# EAGLE design current_monitor_v1.1 (EAGLE 6.5.0)
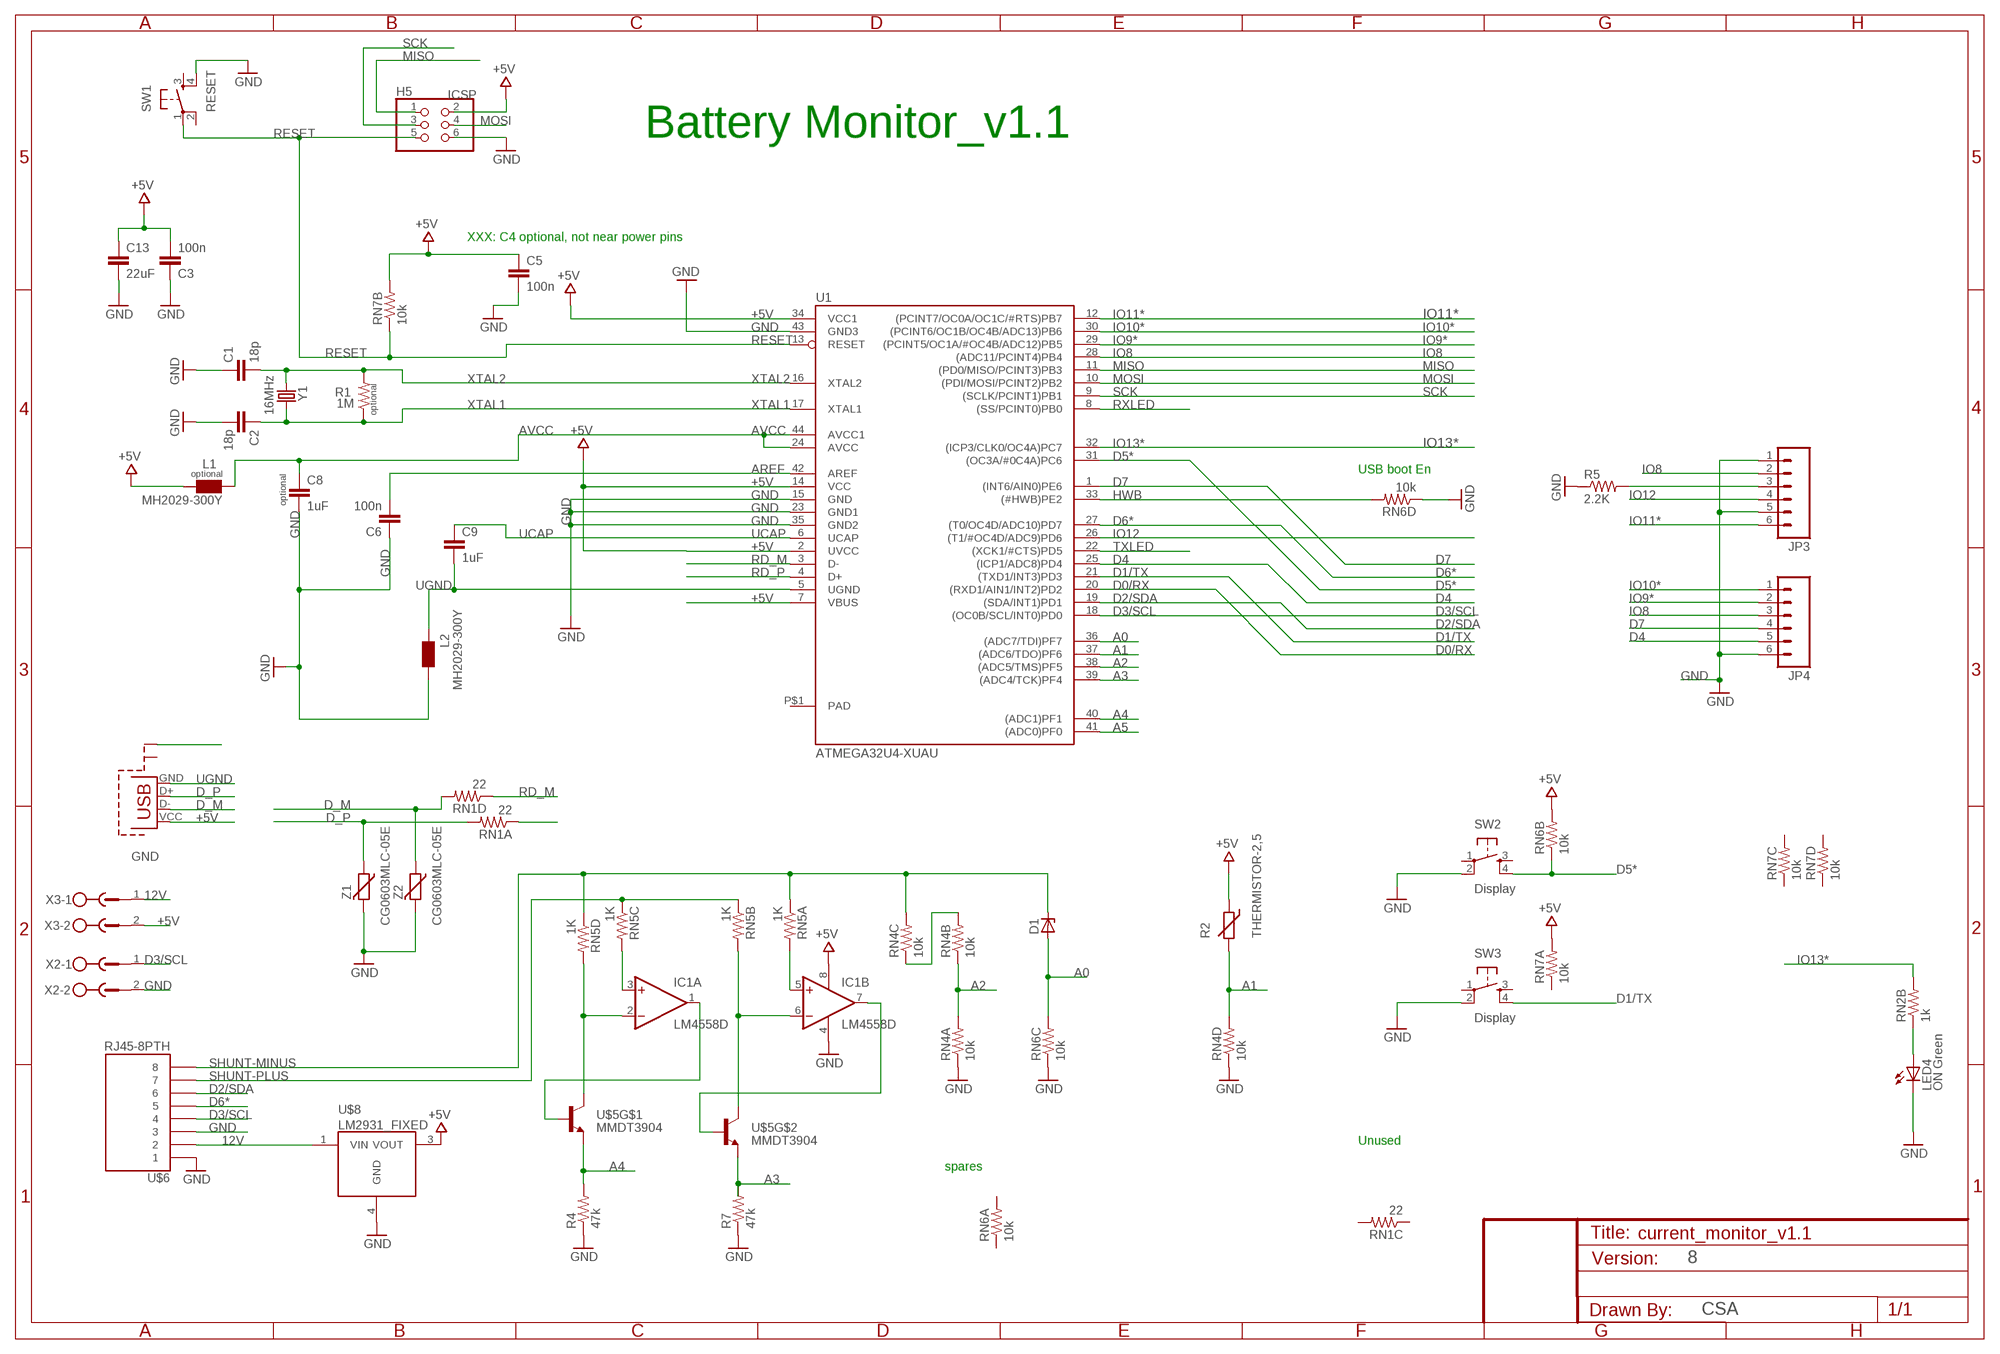
[diagram p0: schematic, sheet 1]

## Parts
C1  18p  CAP0805  [0805]
C2  18p  CAP0805  [0805]
C3  100n  CAP0805  [0805]
C5  100n  CAP0805  [0805]
C6  100n  CAP0805  [0805]
C8  1uF  CAP0805  [0805]
C9  1uF  CAP0805  [0805]
C13  22uF  CAP1206  [1206]
D1  ZENER-DIODEZD-5  [ZDIO-5]
H5  ICSP  PINHD-2X3  [2X03]
IC1  LM4558D  [SO08]
JP3  M06FEMALE_LOCK  [1X06_FEMALE_LOCK.010]
JP4  M06FEMALE_LOCK  [1X06_FEMALE_LOCK.010]
L1  MH2029-300Y  WE-CBF_0805  [0805]
L2  MH2029-300Y  WE-CBF_0805  [0805]
LED4  ON Green  LED0805  [LED0805]
R1  1M  RESISTOR0805-RES  [0805]
R2  THERMISTOR-2,5  [RS-2,5]
R4  47k  RESISTOR0805-RES  [0805]
R5  2.2K  RESISTOR0805-RES  [0805]
R7  47k  RESISTOR0805-RES  [0805]
RN1  22  RESISTOR-ARRAYCRA06S  [CRA06S]
RN2  1k  RESISTOR-ARRAYCRA06S  [CRA06S]
RN4  10k  RESISTOR-ARRAYCRA06S  [CRA06S]
RN5  1K  RESISTOR-ARRAYCRA06S  [CRA06S]
RN6  10k  RESISTOR-ARRAYCRA06S  [CRA06S]
RN7  10k  RESISTOR-ARRAYCRA06S  [CRA06S]
SW1  RESET  TAC_SWITCHPTH  [TACTILE-PTH]
SW2  Display  TAC_SWITCHPTH  [TACTILE-PTH]
SW3  Display  TAC_SWITCHPTH  [TACTILE-PTH]
U1  ATMEGA32U4-XUAU  [TQFP44-PAD]
U$5  MMDT3904  [SOT363]
U$6  RJ45-8PTH  [RJ45-8]
U$8  LM2931_FIXED  [DPAK]
U$12  USB-MICRO-B-EVT  [USB-MICRO-B-UNIVERSAL-SOLID-FOOTS]
X2  MSTBV2  [MSTBV2]
X3  MSTBV2  [MSTBV2]
Y1  16MHz  CRYSTALHC49US  [HC49US]
Z1  CG0603MLC-05E  VARISTORCN0603  [CT/CN0603]
Z2  CG0603MLC-05E  VARISTORCN0603  [CT/CN0603]

## Nets
12V: U$6.2 U$8.1(VIN) X3.1
+5V [power]: C3.2 C5.1 C13.1 H5.2 IC1.8(P:V+) L1.1 R2.1 RN6.7 RN7.7 RN7.8 U1.2(UVCC) U1.7(VBUS) U1.14(VCC) U1.34(VCC1) U$8.3(VOUT) U$12.VCC(VBUS) X3.2
A0: D1.A RN6.6 U1.36((ADC7/TDI)PF7)
A1: R2.2 RN4.5 U1.37((ADC6/TDO)PF6)
A2: RN4.2 RN4.8 U1.38((ADC5/TMS)PF5)
A3: R7.2 U1.39((ADC4/TCK)PF4) U$5.1(E)
A4: R4.2 U1.40((ADC1)PF1) U$5.4(E)
A5: U1.41((ADC0)PF0)
AREF [aref]: C6.2 U1.42(AREF)
AVCC: C8.1 L1.2 U1.24(AVCC) U1.44(AVCC1)
D0/RX: U1.20((RXD1/AIN1/INT2)PD2)
D1/TX: SW3.4 U1.21((TXD1/INT3)PD3)
D2/SDA: U1.19((SDA/INT1)PD1) U$6.6
D3/SCL: U1.18((OC0B/SCL/INT0)PD0) U$6.4 X2.1
D4: JP4.5 U1.25((ICP1/ADC8)PD4)
D5*: RN6.2 SW2.4 U1.31((OC3A/#0C4A)PC6)
D6*: U1.27((T0/OC4D/ADC10)PD7) U$6.5
D7: JP4.4 U1.1((INT6/AIN0)PE6)
D_M: RN1.5 U$12.D- Z2.1
D_P: RN1.8 U$12.D+ Z1.1
GND [gnd]: C1.1 C2.2 C3.1 C5.2 C6.1 C8.2 C13.2 H5.6 IC1.4(P:V-) JP3.1 JP3.5 JP4.6 L2.2 LED4.C R4.1 R5.1 R7.1 RN4.1 RN4.4 RN6.3 RN6.4 SW1.4 SW2.2 SW3.2 U1.15(GND) U1.23(GND1) U1.35(GND2) U1.43(GND3) U$6.1 U$6.3 U$8.4(GND) X2.2 Z1.2 Z2.2
HWB: RN6.5 U1.33((#HWB)PE2)
IO8: JP4.3 U1.28((ADC11/PCINT4)PB4)
IO9*: JP4.2 U1.29((PCINT5/OC1A/#OC4B/ADC12)PB5)
IO10*: JP4.1 U1.30((PCINT6/OC1B/OC4B/ADC13)PB6)
IO11*: JP3.6 U1.12((PCINT7/OC0A/OC1C/#RTS)PB7)
IO12: JP3.4 U1.26((T1/#OC4D/ADC9)PD6)
IO13*: RN2.7 U1.32((ICP3/CLK0/OC4A)PC7)
LED4_ANODE: LED4.A RN2.2
MISO: H5.1 U1.11((PD0/MISO/PCINT3)PB3)
MOSI: H5.4 U1.10((PDI/MOSI/PCINT2)PB2)
N$1: IC1.6(B:-IN) RN5.7 U$5.6(C)
N$2: IC1.3(A:+IN) RN5.6
N$3: IC1.5(B:+IN) RN5.8
N$4: IC1.1(A:OUT) U$5.5(B)
N$5: IC1.7(B:OUT) U$5.2(B)
N$6: IC1.2(A:-IN) RN5.5 U$5.3(C)
N$10: RN4.3 RN4.7
N$12: JP3.3 R5.2
N$14 [power]: JP3.2
N$25: U$12.P$1(SHIELD2)
RD_M: RN1.4 U1.3(D-)
RD_P: RN1.1 U1.4(D+)
RESET: H5.5 RN7.2 SW1.1 U1.13(RESET)
RXLED: U1.8((SS/PCINT0)PB0)
SCK: H5.3 U1.9((SCLK/PCINT1)PB1)
SHUNT-MINUS: D1.C RN4.6 RN5.1 RN5.4 U$6.8
SHUNT-PLUS: RN5.2 RN5.3 U$6.7
TXLED: U1.22((XCK1/#CTS)PD5)
UCAP: C9.1 U1.6(UCAP)
UGND [gnd]: C9.2 L2.1 U1.5(UGND)
XTAL1: C2.1 R1.1 U1.17(XTAL1) Y1.2
XTAL2: C1.2 R1.2 U1.16(XTAL2) Y1.1
Unconnected: RN1.2 RN1.3 RN1.6 RN1.7 RN2.1 RN2.3 RN2.4 RN2.5 RN2.6 RN2.8 RN6.1 RN6.8 RN7.1 RN7.3 RN7.4 RN7.5 RN7.6 SW1.2 SW1.3 SW2.1 SW2.3 SW3.1 SW3.3 U$12.GND U$12.P$4(SHIELD1)

## Notes on the sheet
- Battery Monitor_v1.1
- XXX: C4 optional, not near power pins
- optional
- USB boot En
- optional
- optional
- Unused
- spares
- 8
- CSA

## Power pins joined to a net without a drawn wire
PAD: U1.P$1(PAD)

## Library data of the parts
C1-C3 C5 C6 C8 C9 C13 = SparkFun-Passives:CAP: Capacitor Standard 0603 ceramic capacitor, and 0.1" leaded capacitor.
D1 = diode:ZENER-DIODE: Z-Diode
H5 = SmartPrj:PINHD-2X3: PIN HEADER
IC1 = linear:*4558: OP AMP
JP3 JP4 = SparkFun-Connectors:M06: Header 6 Standard 6-pin 0.1" header. Use with straight break away headers (SKU : PRT-00116), right angle break away headers (PRT-00553), swiss pins (PRT-00743), machine pins (PRT-00117), and female headers (PRT-00115). Molex polarized connector foot print use with SKU : PRT-08094 with associated crimp pins and housings. NOTES ON THE VARIANTS LOCK and LOCK_LONGPADS... This footprint was designed to help hold the alignment of a through-hole component (i.e. 6-pin header) while soldering it into place. You may notice that each hole has been shifted either up or down by 0.005 of an inch from it's more standard position (which is a perfectly straight line). This slight alteration caused the pins (the squares in the middle) to touch the edges of the holes. Because they are alternating, it causes a "brace" to hold the component in place. 0.005 has proven to be the perfect amount of "off-center" position when using our standard breakaway headers. Although looks a little odd when you look at the bare footprint, once you have a header in there, the alteration is very hard to notice. Also, if you push a header all the way into place, it is covered up entirely on the bottom side. This idea of altering the position of holes to aid alignment will be further integrated into the Sparkfun Library for other footprints. It can help hold any component with 3 or more connection pins.
L1 L2 = wuerth-elektronik:WE-CBF: SMD EMI Suppression Ferrite Beads - excellent anti-EMI properties - low DCR - impedances till 3000 ohms - rated current up to 6 A
LED4 = xorduino:LED
R1 R4 R5 R7 = SparkFun-Passives:RESISTOR: Resistor Basic schematic elements and footprints for 0603, 1206, and PTH resistors.
R2 = varistor:THERMISTOR: THERMISTOR
RN1 RN2 RN4-RN7 = xorduino:RESISTOR-ARRAY
SW1-SW3 = SparkFun-Electromechanical:TAC_SWITCH: Momentary Switch Button commonly used for reset or general input. Spark Fun Electronics SKU : COM-00097
U1 = SmartPrj:ATMEGA32U4-XU
U$5 = SparkFun-DiscreteSemi:MMDT3904: Dual NPN transistor
U$6 = SparkFun-Connectors:RJ45-8: RJ45 Jack Simple RJ45, 8-pin connection - connector for common Cat5, Cat5e, and Cat6 Ethernet cables. Footprint not yet proven in production. Connector sku is PRT-00643; Breakout PCB sku is BOB-00716.
U$8 = SparkFun-PowerIC:LM2931_FIXED: LDO regulator with reverse battery protection- very durable!
U$12 = _usb_micro_b:USB-MICRO-B: USB MICRO B SOCKET 2 shielded pins
X2 X3 = con-phoenix-500:MSTBV2: PHOENIX; OC_FARNELL: unknown; OC_NEWARK: unknown
Y1 = SparkFun-FreqCtrl:CRYSTAL: Various standard crystals. Proven footprints. Spark Fun Electronics SKU : COM-00534
Z1 Z2 = varistor:VARISTOR: VARISTOR

## Net classes
0 default: width 0.203 mm, drill 0.406 mm, clearance 0.203 mm
1 power: width 0.203 mm, drill 0.406 mm, clearance 0.203 mm
2 gnd: width 0.203 mm, drill 0.406 mm, clearance 0.203 mm
3 usbvcc: width 0.203 mm, drill 0.406 mm, clearance 0.203 mm
4 aref: width 0.203 mm, drill 0.406 mm, clearance 0.203 mm

## Board
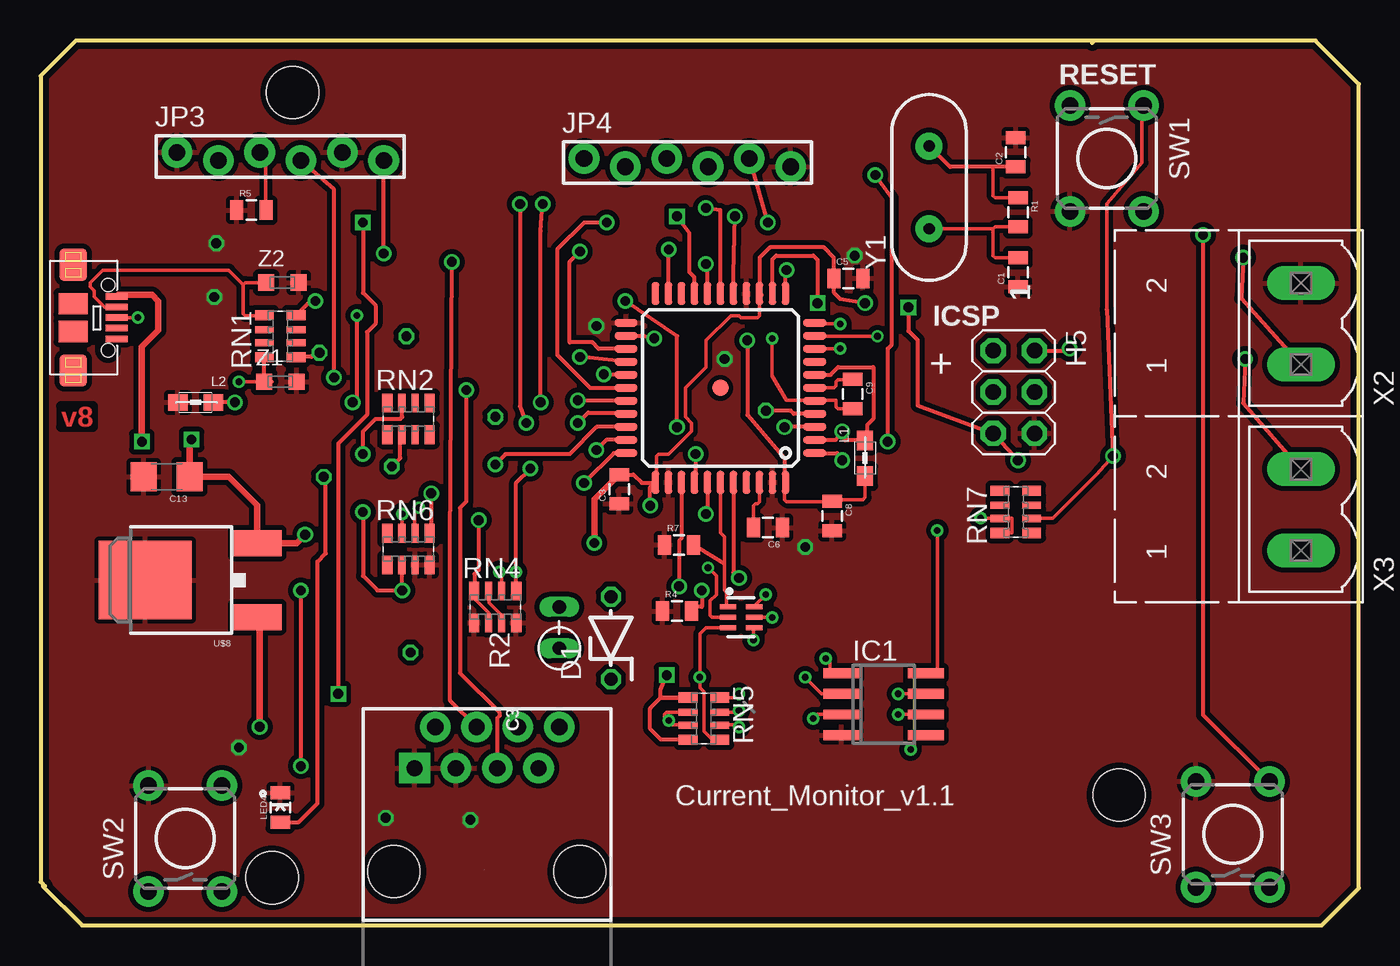
[diagram p1: board, top side]
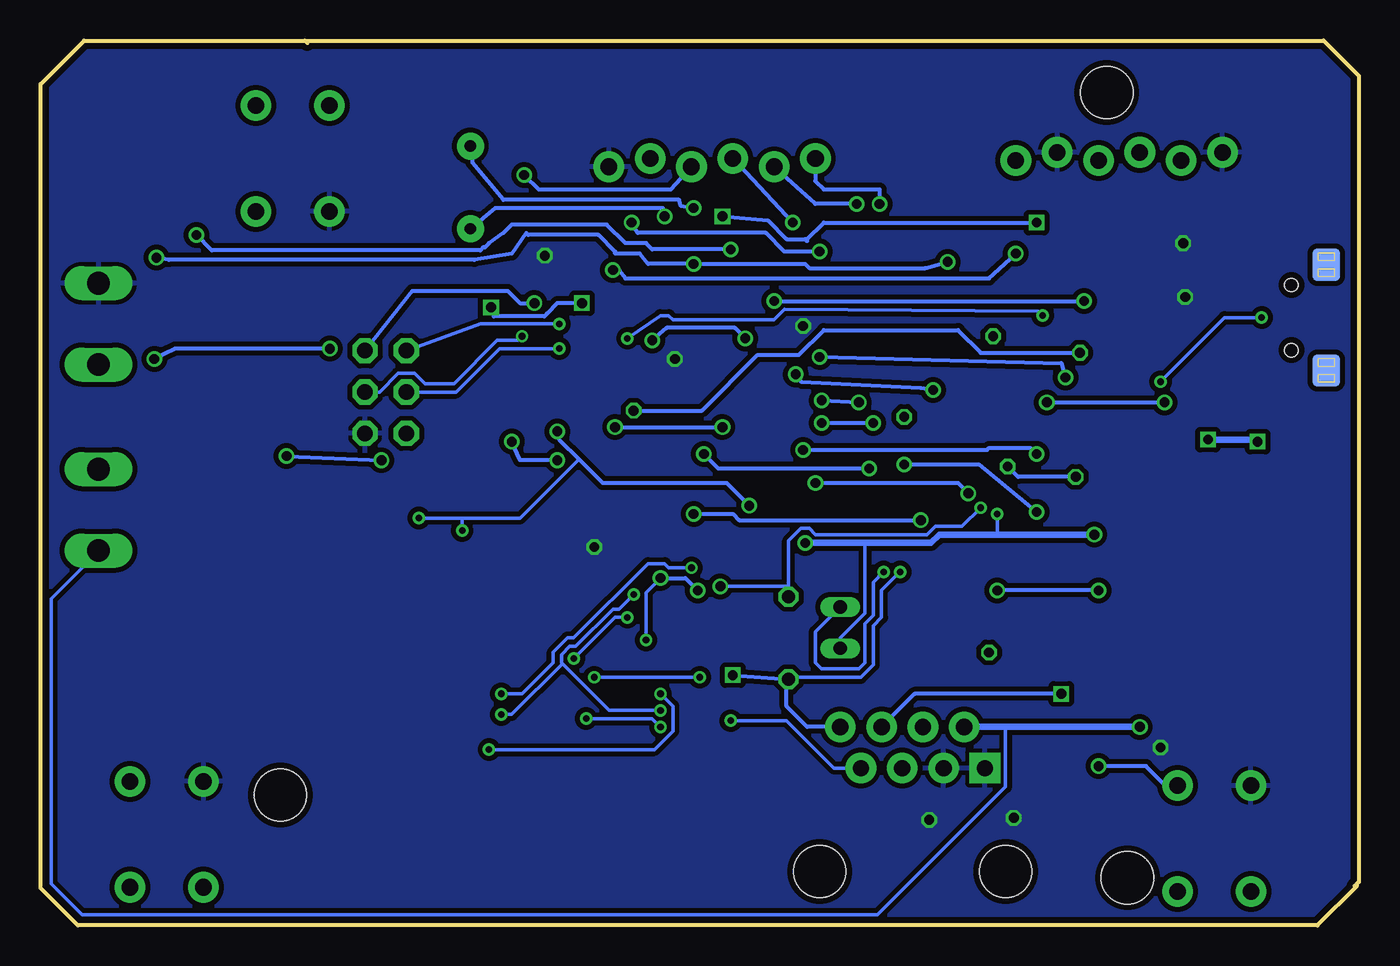
[diagram p2: board, bottom side, seen from below]

Size 81.03 x 54.36 mm. Coordinates in mm from the lower left corner, seen from the top.
Outline: 0.13,2.54 0.13,2.41 2.54,0 78.74,0 81.03,2.29 81.03,51.69 78.36,54.36 64.77,54.36
Outline: 64.77,54.36 2.16,54.36 0,52.2 0,2.67 0.25,2.41
Outline: 64.77,54.36 64.64,54.23
Copper layers (1*16): Top 0.0356mm / dielectric 1.5011mm / Bottom 0.0356mm
Design rules "LaenPCBOrder": minimum track width 6mil, minimum drill 13mil, track to track 6mil, track to pad 6mil, pad to pad 6mil, via to via 6mil, smd to smd 6mil, copper to edge 15mil, drill to drill 6mil, minimum pad ring 7mil, minimum via ring 7mil, stop-mask expansion 4mil, vias tented up to drill 0mil, thermal gap 10mil
Holes 3.2 mm at 66.29,8 15.49,51.18 14.22,2.92

### Footprints (pad centres in the part's own frame; a part is rotated, then mirrored left to right if it is on the bottom)
0805 = smd 0.8 x 1.2: 1 -0.9,0; 2 0.9,0
1206 = smd 1.6 x 1.8: 1 -1.4,0; 2 1.4,0
ZDIO-5 = drill 0.813 octagon: A 2.54,0; C -2.54,0
2X03 = drill 0.95 pad 1.55 octagon: 1 -2.54,-1.27; 2 -2.54,1.27; 3 0,-1.27; 4 0,1.27; 5 2.54,-1.27; 6 2.54,1.27
SO08 = smd 0.6 x 2.2: 1 -1.905,-2.6; 2 -0.635,-2.6; 3 0.635,-2.6; 4 1.905,-2.6; 5 1.905,2.6; 6 0.635,2.6; 7 -0.635,2.6; 8 -1.905,2.6
1X06_FEMALE_LOCK.010 = drill 1.016 pad 1.88: 1 0,0.254; 2 2.54,-0.254; 3 5.08,0.254; 4 7.62,-0.254; 5 10.16,0.254; 6 12.7,-0.254
0805' = smd 1.2 x 1: 1 -1.1,0; 2 1.1,0
LED0805 = smd 0.8 x 1.2: A -0.9,0; C 0.9,0
RS-2,5 = drill 0.813 long: 1 -1.27,0; 2 1.27,0
CRA06S = smd 0.63 x 1.15: 1 -1.295,-0.975; 4 1.295,-0.975; 5 1.295,0.975; 8 -1.295,0.975 | smd 0.44 x 1.15: 2 -0.4,-0.975; 3 0.4,-0.975; 6 0.4,0.975; 7 -0.4,0.975
TACTILE-PTH = drill 1.016 pad 1.88: 1 -3.251,2.261; 2 3.251,2.261; 3 -3.251,-2.261; 4 3.251,-2.261
TQFP44-PAD = smd 1.4 x 0.45: 1 -5.8,4; 2 -5.8,3.2; 3 -5.8,2.4; 4 -5.8,1.6; 5 -5.8,0.8; 6 -5.8,0; 7 -5.8,-0.8; 8 -5.8,-1.6; 9 -5.8,-2.4; 10 -5.8,-3.2; 11 -5.8,-4; 23 5.8,-4; 24 5.8,-3.2; 25 5.8,-2.4; 26 5.8,-1.6; 27 5.8,-0.8; 28 5.8,0; 29 5.8,0.8; 30 5.8,1.6; 31 5.8,2.4; 32 5.8,3.2; 33 5.8,4 | smd 0.45 x 1.4: 12 -4,-5.8; 13 -3.2,-5.8; 14 -2.4,-5.8; 15 -1.6,-5.8; 16 -0.8,-5.8; 17 0,-5.8; 18 0.8,-5.8; 19 1.6,-5.8; 20 2.4,-5.8; 21 3.2,-5.8; 22 4,-5.8; 34 4,5.8; 35 3.2,5.8; 36 2.4,5.8; 37 1.6,5.8; 38 0.8,5.8; 39 0,5.8; 40 -0.8,5.8; 41 -1.6,5.8; 42 -2.4,5.8; 43 -3.2,5.8; 44 -4,5.8 | smd 1 x 1: P$1 0,0
SOT363 = smd 0.3 x 0.99: 1 -0.65,-0.8; 2 0,-0.8; 3 0.65,-0.8; 4 0.65,0.81; 5 0,0.81; 6 -0.65,0.81
RJ45-8 = drill 1 pad 1.88 square: 1 -4.445,6.35 | drill 1 pad 1.88: 2 -3.175,8.89; 3 -1.905,6.35; 4 -0.635,8.89; 5 0.635,6.35; 6 1.905,8.89; 7 3.175,6.35; 8 4.445,8.89 | hole 3.2: -5.715,0; 5.715,0
DPAK = smd 1.6 x 3: 1 -2.28,-5.31; 3 2.28,-5.31 | smd 4.826 x 5.715: 4 0,1.588
USB-MICRO-B-UNIVERSAL-SOLID-FOOTS = smd 0.4 x 1.35: D+ 0,-0.03; D- -0.65,-0.03; GND 1.3,-0.03; ID 0.65,-0.03; VCC -1.3,-0.03 | smd 2 x 1.7 bottom: P$1 -3.25,-2.7; P$5 3.25,-2.7 | smd 1.3 x 1.8: P$2 -0.85,-2.7; P$6 0.85,-2.7 | smd 2 x 1.7: P$3 -3.25,-2.7; P$4 3.25,-2.7 | hole 0.8: -2,-0.55; 2,-0.55
MSTBV2 = drill 1.397 long: 1 -2.5,0; 2 2.5,0
HC49US = drill 0.7 pad 1.651: 1 -2.54,0; 2 2.54,0
CT/CN0603 = smd 1 x 1: 1 -1,0; 2 1,0

### Placement (x,y rotation side)
C1  60.07,40.13 90 top
C2  59.94,47.5 90 top
C3  35.56,26.8 90 top
C5  49.66,39.75 0 top
C6  44.7,24.43 180 top
C8  48.64,25.15 270 top
C9  49.91,32.64 270 top
C13  7.75,27.56 180 top
D1  35.05,17.65 90 top
H5  59.82,32.77 270 top
IC1  51.82,13.59 270 top
JP3  8.38,47.24 0 top
JP4  33.4,46.86 0 top
L1  MH2029-300Y  [0805']  50.67,28.7 270 top
L2  MH2029-300Y  [0805']  9.53,32.13 180 top
LED4  14.73,7.24 90 top
R1  60.07,43.81 270 top
R2  31.88,18.29 90 top
R4  39.12,19.3 0 top
R5  12.95,43.94 0 top
R7  39.24,23.37 0 top
RN1  14.73,36.2 90 top
RN2  22.61,31.12 0 top
RN4  27.94,19.56 0 top
RN5  40.77,12.7 270 top
RN6  22.61,23.11 0 top
RN7  59.94,25.4 90 top
SW1  65.53,47.12 270 top
SW2  8.89,5.33 90 top
SW3  73.28,5.59 90 top
U1  41.78,33.02 180 top
U$5  43.05,18.92 270 top
U$6  27.43,3.3 0 top
U$8  8,21.21 90 top
U$12  4.7,37.34 270 top
X2  77.47,36.96 90 top
X3  77.47,25.53 90 top
Y1  54.61,45.34 90 top
Z1  14.73,33.4 0 top
Z2  14.86,39.5 0 top

### Tracks (layer width: path | path; a pad name or v marks a point on that pad's centre or on a via)
12V  (via drill 0.6)
  Top 0.406: v13.46,12.19 13.46,18.78 U$8.1
  Bottom 0.203: 21.72,12.19 21.72,8.51 29.59,0.64 78.49,0.64 80.39,2.54 80.39,20.07 77.47,22.99 X3.1
  Bottom 0.406: U$6.2 21.72,12.19 v13.46,12.19
+5V  (via drill 0.41, 0.6)
  Top 0.203: U1.14 44.2,38.73 44.2,37.47 44.07,37.34 43.05,37.34 42.93,37.47 42.42,37.47 40.89,35.94 40.89,34.29 39.62,33.02 39.62,31.24 40.01,30.86 40.01,30.35 38.61,28.96 37.97,28.96 37.85,28.83 37.85,27.69 U1.34 | v22.23,25.27 22.23,24.13 RN6.7 | RN7.8 59.06,24.13 59.69,24.13 59.69,25.02 59.06,25.02 RN7.7 58.93,25.02 v57.78,25.02 | IC1.8 55.12,15.49 v55.12,24.26
  Top 0.254: 44.32,38.73 44.24,38.82 U1.14 44.2,38.83 44.2,41.02 44.83,41.66 48.13,41.66 48.76,41.03 C5.1 48.77,39.74 48.77,38.86 49.15,38.48 v50.67,38.23 | U1.2 48.87,29.82 v49.28,30.35 49.45,29.8 L1.1 50.8,29.93 50.8,30.73 51.18,31.12 51.18,34.29 49.02,34.29 48.55,33.82 U1.7 | v37.47,25.78 37.47,26.9 U1.34 37.74,27.18 36.96,27.18 36.44,27.7 C3.2 | H5.2 63.12,35.31 v63.25,35.43 | v74.04,34.8 73.91,32.09 X3.2
  Top 0.406: v16.26,24 15.74,23.49 U$8.3 13.31,25.8 11.56,27.56 C13.1 9.15,29.72 v9.27,29.84 | v34.04,23.5 34.04,26.17 C3.2 | v6.22,29.72 6.22,35.56 7.24,36.58 7.24,38.35 6.86,38.73 4.77,38.73 U$12.VCC
  Bottom 0.203: 22.23,24 v22.23,25.27 | R2.1 31.88,17.65 30.35,19.18 30.35,23.5 | 55.12,25.02 51.56,25.02 47.94,28.64 | 55.12,25.02 v57.78,25.02 | 55.12,25.02 v55.12,24.26
  Bottom 0.254: H5.2 58.17,38.99 52.32,38.99 51.56,38.23 v50.67,38.23 | v49.28,30.35 49.15,29.84 47.94,28.64 46.48,27.18 38.86,27.18 v37.47,25.78 | v63.25,35.43 72.77,35.43 v74.04,34.8
  Bottom 0.406: v16.26,24 22.23,24 25.78,24 26.29,23.5 30.35,23.5 v34.04,23.5 | v9.27,29.84 6.35,29.84 v6.22,29.72
A0  (via drill 0.41, 0.6)
  Top 0.203: v23.24,25.65 22.99,25.4 22.99,24.13 RN6.6
  Top 0.254: U1.36 39.38,23.76 39.24,23.62 v39.24,20.83
  Bottom 0.203: v23.24,25.65 24.38,24.51 26.04,24.51 26.54,24 33.4,24 33.78,24.38 34.29,24.38 35.05,23.62 35.05,20.83 | D1.A 35.05,20.83 | 35.05,20.83 v39.24,20.83
A1  (via drill 0.41, 0.6)
  Top 0.203: v29.21,21.72 29.23,21.72
  Top 0.254: RN4.5 29.23,21.72 29.23,27.2 v30.1,28.07 | v40.26,28.96 40.26,27.3 U1.37
  Bottom 0.203: R2.2 33.4,18.03 33.4,16.13 33.02,15.75 30.73,15.75 30.35,16.13 30.35,18.54 29.84,19.05 29.84,21.08 v29.21,21.72
  Bottom 0.254: v30.1,28.07 39.37,28.07 v40.26,28.96
A2  (via drill 0.6)
  Top 0.203: RN4.8 26.67,20.45 26.67,20.07 27.56,19.18 27.56,18.67 RN4.2
  Top 0.254: U1.38 40.98,25.36 v40.89,25.27 | v26.92,24.89 26.92,21.84 26.67,21.59 26.67,20.56 RN4.8
  Bottom 0.254: v40.89,25.27 38.48,25.27 38.1,24.89 v26.92,24.89
A3
  Top 0.203: 42.04,22.23 42.04,20.57 42.16,20.45 42.16,19.68 U$5.1 | U1.39 41.78,24.13 42.04,23.88 42.04,22.23 | 42.04,22.23 R7.2
A4  (via drill 0.41, 0.6)
  Top 0.203: v43.82,17.53 43.82,18.16 U$5.4
  Top 0.254: U1.40 42.58,21.68 v42.93,21.34 | v40.64,20.57 40.64,19.56 40.27,19.56 R4.2
  Bottom 0.203: v43.82,17.53 43.82,20.45 v42.93,21.34
  Bottom 0.254: v42.93,21.34 41.4,21.34 v40.64,20.57
AREF
  Top 0.203: C6.2 43.82,24.51 43.82,25.78 43.94,25.91 44.07,25.91 44.2,26.04 44.2,27.18 U1.42
AVCC  (via drill 0.6)
  Top 0.203: 47.5,26.04 45.85,26.04 45.72,26.16 45.72,27.18 U1.44 | L1.2 50.67,26.29 50.55,26.16 49.28,26.16 49.15,26.04 47.5,26.04 | 47.5,26.04 C8.1
  Top 0.254: U1.24 37.06,36.22 v37.72,36.07 | v43.43,35.94 43.43,31.37 45.72,28.7 45.72,27.28 U1.44
  Bottom 0.254: v37.72,36.07 38.35,36.7 42.55,36.7 v43.43,35.94
D1/TX  (via drill 0.6)
  Top 0.254: U1.21 38.58,41.5 v38.61,41.53 | v71.45,42.42 71.45,12.93 SW3.4
  Bottom 0.254: v38.61,41.53 43.43,41.53 43.82,41.91 45.09,41.91 46.23,43.05 52.07,43.05 52.58,42.55 53.47,41.91 53.72,41.66 53.82,41.66 54,41.48 70.51,41.48 v71.45,42.42
D2/SDA  (via drill 0.6)
  Top 0.254: U1.19 40.18,39.83 39.88,40.13 39.88,42.55 v39.12,43.56 | v19.81,43.18 19.81,38.86 20.57,38.1 20.57,36.96 20.07,36.45 20.07,31.37 18.29,29.59 v18.29,14.22
  Bottom 0.254: v39.12,43.56 36.32,43.31 35.18,42.16 34.04,42.16 33.91,42.04 33.91,42.16 32.89,43.18 v19.81,43.18 | v18.29,14.22 27.3,14.22 U$6.6
D3/SCL  (via drill 0.6)
  Top 0.254: v25.27,40.77 25.15,23.24 25.15,13.84 U$6.4 | U1.18 40.98,40.55 v40.89,40.64 | v73.91,41.02 73.79,38.52 X2.1
  Bottom 0.254: v25.27,40.77 26.67,40.39 33.78,40.39 34.04,40.64 v40.89,40.64 43.69,40.64 44.2,41.27 45.72,41.27 45.72,41.4 46.74,42.42 51.05,42.42 51.18,42.55 52.07,41.27 54.36,40.89 73.15,40.89 v73.91,41.02
D4  (via drill 0.6)
  Top 0.254: U1.25 34.3,35.42 33.91,35.81 32.51,35.81 32.51,40.77 v33.15,41.4 | v44.7,43.18 43.69,46.74 JP4.5
  Bottom 0.254: v33.15,41.4 35.31,41.4 36.45,42.55 44.32,42.55 v44.7,43.18
D5*  (via drill 0.6)
  Top 0.254: v16,9.78 v16,20.57 | RN6.2 22.23,22.12 v22.23,20.57 20.7,20.57 19.81,21.46 v19.81,25.4 | U1.31 34.18,30.62 32.51,28.96 28.58,28.96 v27.94,28.32
  Bottom 0.254: SW2.4 11.89,8.59 13.08,9.78 v16,9.78 | v16,20.57 v22.23,20.57 | v27.94,28.32 23.37,28.32 v19.81,25.4
D6*  (via drill 0.6)
  Top 0.254: U1.27 34.84,33.82 v34.62,33.86 | v26.16,32.89 26.16,26.04 25.78,25.65 25.78,15.49 28.19,13.08 28.19,12.85 28.07,12.72 U$6.5
  Bottom 0.254: v34.62,33.86 34.67,33.78 34.29,33.4 26.92,33.02 v26.16,32.89
D7  (via drill 0.6)
  Top 0.254: U1.1 48.96,29.02 v49.28,28.57 | v52.07,29.72 52.07,35.43 52.32,35.69 52.32,44.7 v51.31,46.1
  Bottom 0.254: v49.28,28.57 51.56,28.57 v52.07,29.72 | v51.31,46.1 50.42,45.21 42.29,45.21 JP4.4
D_M
  Top 0.203: Z2.1 12.57,39.5 12.45,39.37 | 12.45,39.37 12.45,37.59 12.57,37.47 13.72,37.47 RN1.5 | 12.45,39.37 11.56,40.26 3.81,40.26 3.05,39.5 3.05,39.24 3.3,38.99 3.3,38.61 3.94,37.97 4.57,37.97 U$12.D-
D_P  (via drill 0.41)
  Top 0.203: 14.22,33.4 Z1.1 v12.19,33.4 | v5.97,37.34 U$12.D+
  Top 0.254: Z1.1 13.73,34.88 RN1.8
  Bottom 0.203: v5.97,37.34 8.26,37.34 v12.19,33.4
GND  (via drill 0.6)
  other vias: 42.04,34.8 46.99,23.24 50.04,41.15 10.79,41.91 10.67,38.61 12.19,10.92 21.21,6.6 26.42,6.48 34.16,36.83
  pour Bottom (isolate 0.305): 0.25,1.65 0.25,52.45 1.52,53.72 81.15,54.1 81.03,0.13 2.79,0.38
  pour Top (isolate 0.305): 0.25,1.65 0.25,52.45 1.52,53.72 81.28,54.23 80.77,0 2.29,0.38
HWB  (via drill 0.6)
  Top 0.254: U1.33 35.24,29.02 v33.4,27.18 | v24,26.54 24,24.19 RN6.5
  Bottom 0.254: v33.4,27.18 24.64,27.18 v24,26.54
IO8  (via drill 0.6)
  Top 0.254: v34.8,43.18 33.4,43.18 31.75,41.53 31.75,35.05 33.78,33.02 U1.28
  Bottom 0.254: v34.8,43.18 JP4.3
IO9*  (via drill 0.6)
  Top 0.254: U1.29 33.06,32.22 v33.02,32.26 | v30.73,32.13 30.73,42.67 v30.86,44.32
  Bottom 0.254: v33.02,32.26 v30.73,32.13 | v30.86,44.32 33.4,44.32 JP4.2
IO10*  (via drill 0.6)
  Top 0.203: 36.07,31.37 U1.30
  Top 0.254: v29.46,44.32 29.46,31.88 v29.84,30.86 | v33.02,30.86 33.66,31.5 35.91,31.5 U1.30 | 36.07,31.37 35.94,31.5
  Bottom 0.254: JP4.1 33.4,45.72 32.89,45.21 29.46,45.21 v29.46,44.32 | v29.84,30.86 v33.02,30.86
IO11*  (via drill 0.6)
  Top 0.254: U1.12 45.78,40.2 v45.85,40.26 | v21.08,41.27 JP3.6
  Bottom 0.254: v45.85,40.26 45.47,40.26 45.09,39.75 22.73,39.75 v21.08,41.27
IO12  (via drill 0.6)
  Top 0.254: U1.26 33.73,34.87 v33.15,34.92 | v18.03,33.66 18.03,45.21 JP3.4
  Bottom 0.254: v33.15,34.92 18.29,34.54 v18.03,33.66
IO13*  (via drill 0.6)
  Top 0.254: U1.32 34.77,29.82 v34.16,29.21 | v19.81,28.96 19.81,30.35 20.57,31.12 22.1,31.12 22.23,31.24 22.23,32.07 RN2.7
  Bottom 0.254: v34.16,29.21 22.86,29.21 22.73,29.34 20.19,29.34 v19.81,28.96
LED4_ANODE  (via drill 0.6)
  Top 0.254: LED4.A 15.86,6.34 17.02,7.49 17.02,22.35 17.53,22.86 17.53,27.43 v17.4,27.56 | v21.59,28.19 22.1,28.7 22.1,30.03 RN2.2
  Bottom 0.254: v17.4,27.56 20.96,27.56 v21.59,28.19
MISO  (via drill 0.41)
  Top 0.203: v49.15,36.96 47.62,36.96 U1.11
  Bottom 0.203: v49.15,36.96 53.98,36.96 H5.1
MOSI  (via drill 0.41)
  Top 0.203: v51.44,36.2 47.62,36.2 U1.10
  Bottom 0.203: H5.4 60.2,32.77 59.06,33.91 58.04,33.91 57.4,33.27 55.63,33.27 52.96,35.94 51.69,35.94 v51.44,36.2
N$1  (via drill 0.41)
  Top 0.203: v44.58,20.32 43.94,19.68 U$5.6 | v42.93,13.21 42.8,13.08 41.78,13.08 RN5.7 | v52.7,12.95 IC1.6
  Bottom 0.203: v44.58,20.32 45.47,19.43 45.85,19.43 48.13,17.14 48.51,17.14 49.02,16.64 49.02,16.13 48.96,16.06 | 48.96,16.06 46.1,13.21 v42.93,13.21 | v52.7,12.95 52.07,12.95 48.96,16.06
N$2  (via drill 0.41)
  Top 0.203: v42.93,12.19 42.8,12.32 41.78,12.32 RN5.6 | v47.5,12.7 47.75,12.95 IC1.3
  Bottom 0.203: v42.93,12.19 43.43,12.7 v47.5,12.7
N$3  (via drill 0.41)
  Top 0.203: v42.93,14.22 42.67,13.97 41.78,13.97 RN5.8 | v53.47,10.79 53.72,11.05 53.72,11.68 IC1.5
  Bottom 0.203: v42.93,14.22 42.16,13.46 42.16,11.94 43.31,10.79 v53.47,10.79
N$4  (via drill 0.41)
  Top 0.203: v44.96,18.92 U$5.5 | v48.26,16.38 48.51,16.13 48.51,15.49 IC1.1
  Bottom 0.203: v44.96,18.92 45.72,18.92 v48.26,16.38
N$5  (via drill 0.41)
  Top 0.203: U$5.2 41.27,18.92 41.15,19.05 41.15,19.94 41.53,20.32 41.53,21.46 v41.02,21.97 | IC1.7 v52.7,14.22
  Bottom 0.203: v41.02,21.97 42.42,21.97 42.67,22.23 43.69,22.23 48.26,17.65 48.64,17.65 49.53,16.76 49.53,16.13 51.44,14.22 v52.7,14.22
N$6  (via drill 0.41)
  Top 0.203: U$5.3 42.16,18.29 40.89,18.29 40.51,17.91 v40.51,15.24 40.51,14.61 40.77,14.35 40.77,11.94 41.27,11.43 41.66,11.43 RN5.5 | IC1.2 48.01,14.22 v46.99,15.24
  Bottom 0.203: v40.51,15.24 v46.99,15.24
N$9  (via drill 0.6)
  other vias: 27.94,31.24
N$10
  Top 0.203: RN4.7 27.56,20.45 27.56,19.81 28.32,19.05 28.32,18.67 RN4.3
N$12
  Top 0.203: JP3.3 13.84,47.12 R5.2
N$20  (via drill 0.6)
  other vias: 22.73,16.76
N$24  (via drill 0.6)
  other vias: 22.48,36.2
RD_M  (via drill 0.6)
  Top 0.254: U1.3 v45.73,30.62 v45.72,30.61 | v39.12,30.61 39.12,36.2 v35.94,38.35 | v16.89,38.35 16.57,38.35 RN1.4
  Bottom 0.254: v45.72,30.61 v39.12,30.61 | v35.94,38.35 v16.89,38.35
RD_P  (via drill 0.6)
  Top 0.254: U1.4 46.3,31.42 46.1,31.62 v44.58,31.62 | v17.15,35.18 16.89,35.18 16.64,34.92 15.73,34.92 RN1.1
  Bottom 0.254: v44.58,31.62 40.39,31.62 36.96,35.05 34.42,35.05 32.89,36.58 24.64,36.58 23.24,35.18 v17.15,35.18
RESET  (via drill 0.6)
  Top 0.203: 65.53,37.85 65.53,44.32 67.69,46.86 67.69,50.29 SW1.1 | v65.91,28.83 64.9,27.69 62.23,25.02 60.96,25.02 RN7.2
  Top 0.254: U1.13 44.98,40.92 45.21,41.15 47.5,41.15 47.75,40.89 v47.75,38.23 | v53.34,37.97 53.34,36.52 53.9,35.97 53.9,31.95 H5.5 58.8,29.97 v60.07,28.57 | 65.53,37.85 v65.91,28.83
  Bottom 0.254: v47.75,38.23 49.28,38.23 49.91,37.59 49.91,37.57 50.06,37.41 53.16,37.41 v53.34,37.97 | v65.91,28.83 v60.07,28.57
SCK  (via drill 0.41)
  Top 0.203: v49.15,35.43 47.62,35.43 U1.9
  Bottom 0.203: v49.15,35.43 52.83,35.43 55.5,32.77 H5.3
SHUNT-MINUS  (via drill 0.41, 0.6)
  Top 0.203: v28.19,21.72 28.32,21.59 28.32,20.57 RN4.6
  Top 0.254: RN5.4 38.12,11.4 37.47,12.06 37.47,13.34 38.1,13.97 | 38.1,13.97 39.77,13.97 RN5.1 38.12,14 38.1,13.97 | 38.1,13.97 38.1,14.48 v38.48,15.37
  Bottom 0.203: v28.19,21.72 29.34,20.57 29.34,18.92 29.84,18.41 29.84,16 30.61,15.24 34.93,15.24 D1.C
  Bottom 0.254: U$6.8 33.91,12.19 35.18,13.46 35.18,14.99 | 35.18,14.99 D1.C v38.48,15.37 | 35.18,15.24 35.18,14.99
SHUNT-PLUS  (via drill 0.41)
  Top 0.203: 38.42,12.38 38.35,12.45 38.35,12.95 38.48,13.08 39.75,13.08 RN5.2 | 38.42,12.38 38.48,12.32 39.75,12.32 RN5.3 | v38.61,12.57 38.42,12.38
  Bottom 0.203: v38.61,12.57 35.18,12.57 32.26,9.65 U$6.7
UCAP
  Top 0.203: U1.6 48.77,33.02 48.9,33.15 48.9,33.4 49.02,33.53 50.42,33.53 C9.1
UGND  (via drill 0.41, 0.6)
  Top 0.203: C9.2 50.42,31.75 49.02,31.75 48.9,31.88 48.9,32.26 47.62,32.26 U1.5 47.5,32.26 45.85,32.26 44.96,33.78 v44.96,36.07
  Top 0.254: v19.43,37.47 19.43,32.38 v19.18,32.13 | v11.94,32.13 L2.1
  Bottom 0.203: v19.43,37.47 19.69,37.72 35.31,37.85 35.94,37.21 42.16,37.21 42.42,37.47 42.93,37.47 v44.96,36.07
  Bottom 0.254: v19.18,32.13 v11.94,32.13
XTAL1  (via drill 0.6)
  Top 0.203: 58.55,46.6 58.55,44.83 58.67,44.7 R1.1
  Top 0.254: U1.17 41.78,43.94 v40.89,44.07 | C2.1 58.55,46.6 55.89,46.6 Y1.2
  Bottom 0.254: v40.89,44.07 41.66,44.2 41.78,44.58 52.58,44.58 54.48,46.86 54.48,47.75 Y1.2
XTAL2  (via drill 0.6)
  Top 0.203: 58.55,42.8 58.55,41.15 58.67,41.02 C1.2 | 58.55,42.8 58.67,42.93 60.07,42.93 R1.2 | Y1.1 58.55,42.8
  Top 0.254: U1.16 42.55,38.82 v42.67,43.56
  Bottom 0.254: v42.67,43.56 42.8,44.07 53.09,44.07 Y1.1

### Text on the board
Top: v8
tPlace: RESET | 1 | ICSP | + | C3 | Current_Monitor_v1.1
tValues: Display | Display | To Battery | Menu